# Altium schematic sheet Sheet1.SchDoc
size A4
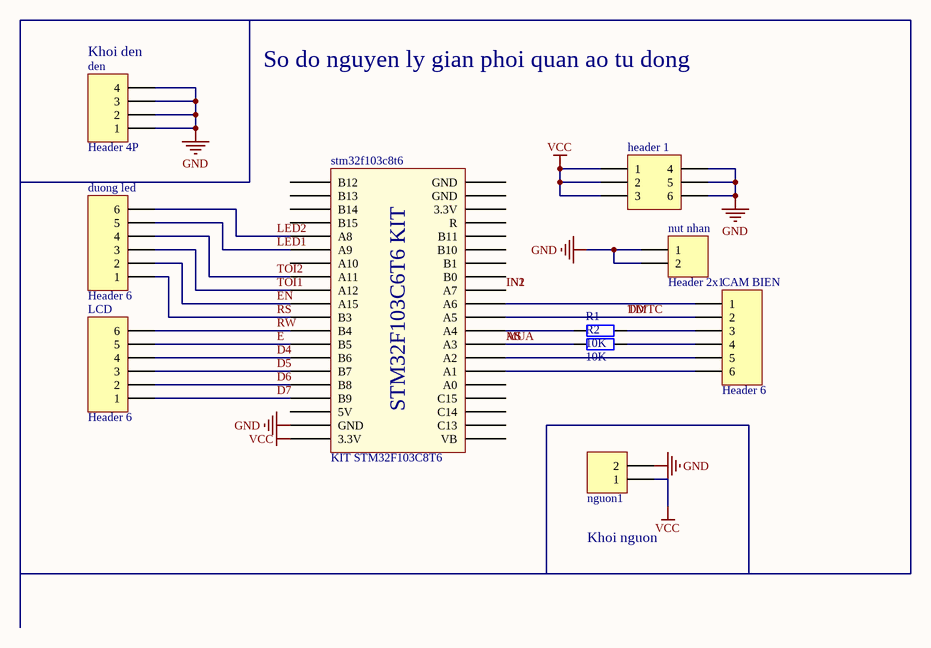
[diagram p0: Sheet1.SchDoc]

## Parts
CAM_BIEN  Header 6  [HDR1X6]
den  Header 4P  [HDR1X4]
duong_led  Header 6  [HDR1X6]
header_1  Header 3X2A  [HDR2X3_CEN]  (value not drawn)
LCD  Header 6  [HDR1X6]
nguon1  Header 2_1  [HED2]  (value not drawn)
nut_nhan  Header 2x1  [HDR1X2]
R1  10K  [R1/4W]
R2  10K  [R1/4W]
stm32f103c8t6  KIT STM32F103C8T6  [STM32F103 KIT]

## Nets
GND: den.1 den.2 den.3 den.4 header_1.4 header_1.5 header_1.6 nguon1.2 nut_nhan.1 nut_nhan.2 stm32f103c8t6.19(GND)
VCC: header_1.1 header_1.2 header_1.3 nguon1.1 stm32f103c8t6.20(3.3V)
AS: R2.1 stm32f103c8t6.28(A3)  [also labelled MUA]
D4: LCD.4 stm32f103c8t6.14(B6)
D5: LCD.3 stm32f103c8t6.15(B7)
D6: LCD.2 stm32f103c8t6.16(B8)
D7: LCD.1 stm32f103c8t6.17(B9)
DM: CAM_BIEN.2 stm32f103c8t6.30(A5)  [also labelled TD/TC]
E: LCD.5 stm32f103c8t6.13(B5)
EN: duong_led.2 stm32f103c8t6.10(A15)
IN1: stm32f103c8t6.32(A7)  [also labelled IN2]
LED1: duong_led.5 stm32f103c8t6.6(A9)
LED2: duong_led.6 stm32f103c8t6.5(A8)
RS: duong_led.1 stm32f103c8t6.11(B3)
RW: LCD.6 stm32f103c8t6.12(B4)
TOI1: duong_led.3 stm32f103c8t6.9(A12)
TOI2: duong_led.4 stm32f103c8t6.8(A11)
NetCAM_BIEN_1: CAM_BIEN.1 stm32f103c8t6.31(A6)
NetCAM_BIEN_3: CAM_BIEN.3 R1.2
NetCAM_BIEN_4: CAM_BIEN.4 R2.2
NetCAM_BIEN_5: CAM_BIEN.5 stm32f103c8t6.27(A2)
NetCAM_BIEN_6: CAM_BIEN.6 stm32f103c8t6.26(A1)
NetR1_1: R1.1 stm32f103c8t6.29(A4)

Not connected (* = marked no-connect by the designer): stm32f103c8t6 1(B12) 2(B13) 3(B14) 4(B15) 7(A10) 18(5V) 21(VB) 22(C13) 23(C14) 24(C15) 25(A0) 33(B0) 34(B1) 35(B10) 36(B11) 37(R) 38(3.3V) 39(GND) 40(GND)

## Notes on the sheet
- (near den) Khoi den
- So do nguyen ly gian phoi quan ao tu dong
- (near nguon1) Khoi nguon
- (in symbol STM32f103 Bluepill) STM32F103C6T6 KIT

## Library data of the parts
CAM_BIEN duong_led LCD = Header 6: Header, 6-Pin; Solder: WAVE
den = Header 4x1: Header, 4 Pin Pitch 2.54mm; MPN: S1012EC-40-ND; CompanyID: VT-00125; Solder: WAVE; Value: Header 4P
header_1 = Header 3X2A: Header, 3-Pin, Dual row; Solder: WAVE
nguon1 = Header 2_1: Header, 2-Pin; Manufacturer: Generic Components; Class: Connector; Value: Header 2
nut_nhan = Header 2x1: Header, 2-Pin, pitch 2.54mm; Solder: WAVE
R1 R2 = R1/4W: Resistor 1/4W; Value: R1/4W - 1K
stm32f103c8t6 = STM32f103 Bluepill: KIT STM32F103C8T6 Bluepill